# Altium project 6QChan_vitalcore_backpack.PrjPcb
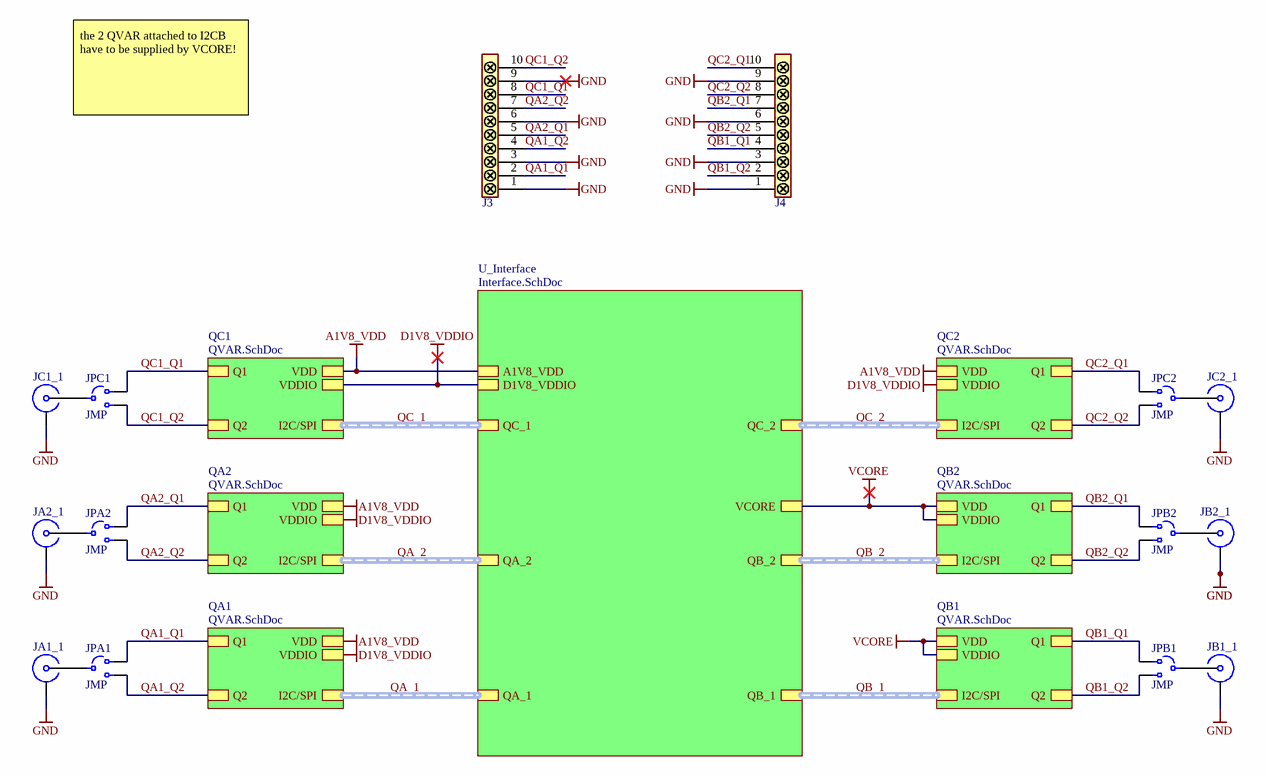
[diagram p0: main.SchDoc]
CAGE_CODE: ?????; CheckedBy: topolonelli, nschae, peterste; CONTRACT_NUMBER: <CONTRACT NO>; DOC_NO_ASSY_DWG: <ASSY DWG NO>; DOC_NO_BOM: <BOM DOC NO>; DOC_NO_FAB_DWG: <FAB DWG NO>; DOC_NO_SCH_DWG: <SCH DWG NO>; DrawnBy: villanif; Organization: PBL, IIS; PCB_2_DEC_TOL: +/-.01; PCB_3_DEC_TOL: +/-.010; PCB_ANG_TOL: +/-1/2; PCB_ASSEMBLY_NO: <PCB ASSY NO>; PCB_CHECKER: - -----; PCB_CHECKER_APP_DATE: --/--/----; PCB_DESIGNER: - -----; PCB_DESIGNER_APP_DATE: --/--/----; PCB_DWG_NO: <PCB DWG NO>; PCB_ENGINEER: - -----; PCB_ENGINEER_APP_DATE: --/--/----; PCB_PART_NUMBER: <PCB PN>; PCB_REV: A; ProjectTitle: Qvar 6 Channel Vitalcore Backpack; Revision: 1.0; SCH_REV: A
3 sheets, 119 parts. Net scope: hierarchical (ports join the sheet entries above them; power ports are global).
Board file: QVAR6_VC_Backpack.PcbDoc
Sheets:
  main.SchDoc
    QA1 = QVAR.SchDoc
    U_Interface = Interface.SchDoc
    QA2 = QVAR.SchDoc
    QB1 = QVAR.SchDoc
    QB2 = QVAR.SchDoc
    QC1 = QVAR.SchDoc
    QC2 = QVAR.SchDoc

## Sheet main.SchDoc: Main
size A4; ENG_APP_DATE: --/--/--; DSN_APP_DATE: --/--/--; CHK_APP_DATE: --/--/--; Organization: ETHZ D-ITET PBL; DocumentNumber: 1; SheetNumber: 1; SheetTotal: 3; FileInfo: main.SchDoc

### Parts
J3  FTS-110-01-L-S  [SAMTEC-FTS-110-01-L-S]  (value not drawn)
J4  FTS-110-01-L-S  [SAMTEC-FTS-110-01-L-S]  (value not drawn)
JA1_1  CONMHF1-SMD-G-T  [C-CONMHF1-SMD-G-T]  (value not drawn)
JA2_1  CONMHF1-SMD-G-T  [C-CONMHF1-SMD-G-T]  (value not drawn)
JB1_1  CONMHF1-SMD-G-T  [C-CONMHF1-SMD-G-T]  (value not drawn)
JB2_1  CONMHF1-SMD-G-T  [C-CONMHF1-SMD-G-T]  (value not drawn)
JC1_1  CONMHF1-SMD-G-T  [C-CONMHF1-SMD-G-T]  (value not drawn)
JC2_1  CONMHF1-SMD-G-T  [C-CONMHF1-SMD-G-T]  (value not drawn)
JPA1  JMP  [JMP_0201_3way]
JPA2  JMP  [JMP_0201_3way]
JPB1  JMP  [JMP_0201_3way]
JPB2  JMP  [JMP_0201_3way]
JPC1  JMP  [JMP_0201_3way]
JPC2  JMP  [JMP_0201_3way]

### Sub-sheets
QA1 = QVAR.SchDoc: Q1, Q2, VDD, VDDIO, I2C/SPI (harness I2C/SPI)
QA2 = QVAR.SchDoc: Q1, Q2, VDD, VDDIO, I2C/SPI (harness I2C/SPI)
QB1 = QVAR.SchDoc: Q1, Q2, VDD, VDDIO, I2C/SPI (harness I2C/SPI)
QB2 = QVAR.SchDoc: Q1, Q2, VDD, VDDIO, I2C/SPI (harness I2C/SPI)
QC1 = QVAR.SchDoc: Q1, Q2, VDD, VDDIO, I2C/SPI (harness I2C/SPI)
QC2 = QVAR.SchDoc: Q1, Q2, VDD, VDDIO, I2C/SPI (harness I2C/SPI)
U_Interface = Interface.SchDoc: QA_1 (harness I2C/SPI), QA_2 (harness I2C/SPI), QB_1 (harness I2C/SPI), QB_2 (harness I2C/SPI), QC_1 (harness I2C/SPI), QC_2 (harness I2C/SPI), D1V8_VDDIO, A1V8_VDD, VCORE

### Nets
A1V8_VDD: sheet QA1/VDD, sheet U_Interface/A1V8_VDD, sheet QA2/VDD, sheet QC1/VDD, sheet QC2/VDD
D1V8_VDDIO: sheet QA1/VDDIO, sheet U_Interface/D1V8_VDDIO, sheet QA2/VDDIO, sheet QC1/VDDIO, sheet QC2/VDDIO
GND: J3.1 J3.3 J3.6 J3.9 J4.1 J4.3 J4.6 J4.9 JA1_1.G JA2_1.G JB1_1.G JB2_1.G JC1_1.G JC2_1.G
VCORE: sheet U_Interface/VCORE, sheet QB1/VDD, sheet QB1/VDDIO, sheet QB2/VDD, sheet QB2/VDDIO
QA1_Q1: J3.2 JPA1.1 ; sheet QA1/Q1
QA1_Q2: J3.4 JPA1.3 ; sheet QA1/Q2
QA2_Q1: J3.5 JPA2.1 ; sheet QA2/Q1
QA2_Q2: J3.7 JPA2.3 ; sheet QA2/Q2
QB1_Q1: J4.4 JPB1.1 ; sheet QB1/Q1
QB1_Q2: J4.2 JPB1.3 ; sheet QB1/Q2
QB2_Q1: J4.7 JPB2.1 ; sheet QB2/Q1
QB2_Q2: J4.5 JPB2.3 ; sheet QB2/Q2
QC1_Q1: J3.8 JPC1.1 ; sheet QC1/Q1
QC1_Q2: J3.10 JPC1.3 ; sheet QC1/Q2
QC2_Q1: J4.10 JPC2.1 ; sheet QC2/Q1
QC2_Q2: J4.8 JPC2.3 ; sheet QC2/Q2
NetJA1_1_S: JA1_1.S JPA1.2
NetJA2_1_S: JA2_1.S JPA2.2
NetJB1_1_S: JB1_1.S JPB1.2
NetJB2_1_S: JB2_1.S JPB2.2
NetJC1_1_S: JC1_1.S JPC1.2
NetJC2_1_S: JC2_1.S JPC2.2

### Buses and harness runs
harness QA_1 = sheet QA1/I2C/SPI = sheet U_Interface/QA_1
harness QA_2 = sheet QA2/I2C/SPI = sheet U_Interface/QA_2
harness QB_1 = sheet QB1/I2C/SPI = sheet U_Interface/QB_1
harness QB_2 = sheet QB2/I2C/SPI = sheet U_Interface/QB_2
harness QC_1 = sheet QC1/I2C/SPI = sheet U_Interface/QC_1
harness QC_2 = sheet QC2/I2C/SPI = sheet U_Interface/QC_2

### Notes on the sheet
- the 2 QVAR attached to I2CB have to be supplied by VCORE!
- Project:
- Laboratory:
- Date:
- File:
- Rev:
- Variation:
- Drawn By:
- Checked By:
- Sheet:
- /

### Library data of the parts
J3 J4 = FTS-110-01-L-S: Pinheader 10 pin, 1.27mm; Manufacturer: Samtec; Manufacturer Series: FTS; Connector Type: BOARD CONNECTOR; Option: General Purpose; Mixed Contacts: No; Number of Rows Loaded: 1; Number of Contacts: 10; Additional Feature: Low Profile; Supplier 1: Mouser; Manufacturer Part Number: FTS-110-01-L-S; RoHS: Yes; Category: Connectors; Stock 1: 83; Pricing 1: 1=2.85, 10=2.62, 50=2.62, 100=2.28, 1000=1.66, 10000=1.48 (USD); Mounting Technology: Board; Contact Material: Bronze; Contact Finish - Mating: GOLD (10) OVER NICKEL (50); Contact Finish - Termination: Matte Tin (Sn) - with Nickel (Ni) barrier; JESD-609 Code: e3; Contact Gender: Male; Mounting Style: STRAIGHT; Termination: Solder; Terminal Pitch: 1.27mm; Flammability Rating: UL94 V-0; IEC Conformance: No; MIL Conformance: No; Reach SVHC Compliant: Yes; RoHS Compliant: Yes; ComponentLink1URL: https://datasheet.ciiva.com:443/pdfs/VipMasterIC/IC/SAMI/SAMI-S-A0001504673/SAMI-S-A0001504673-1.pdf?src-supplier=IHS+Markit; ComponentLink1Description: https://datasheet.ciiva.com:443/pdfs/VipMasterIC/IC/SAMI/SAMI-S-A0001504673/SAMI-S-A0001504673-1.pdf?src-supplier=IHS+Markit; Supplier Part Number 1: 200-FTS11001LS; ComponentLink2Description: http://www.samtec.com/documents/webfiles/pdf/FTS.pdf?src-supplier=Avnet; ComponentLink2URL: http://www.samtec.com/documents/webfiles/pdf/FTS.pdf?src-supplier=Avnet; ComponentLink3Description: https://datasheet.octopart.com/FTS-110-01-L-S-Samtec-datasheet-151470456.pdf?src-supplier=Sager+Electronics; ComponentLink3URL: https://datasheet.octopart.com/FTS-110-01-L-S-Samtec-datasheet-151470456.pdf?src-supplier=Sager+Electronics; ComponentLink4Description: https://datasheet.octopart.com/FTS-110-01-L-S-Samtec-datasheet-118493358.pdf?src-supplier=Electro+Sonic; ComponentLink4URL: https://datasheet.octopart.com/FTS-110-01-L-S-Samtec-datasheet-118493358.pdf?src-supplier=Electro+Sonic; ComponentLink5Description: https://datasheet.octopart.com/FTS-110-01-L-S-Samtec-datasheet-116535195.pdf?src-supplier=Toby+Electronics; ComponentLink5URL: https://datasheet.octopart.com/FTS-110-01-L-S-Samtec-datasheet-116535195.pdf?src-supplier=Toby+Electronics; DIN Conformance: No; Filter Feature: No
JA1_1 JA2_1 JB1_1 JB2_1 JC1_1 JC2_1 = CONMHF1-SMD-G-T: Conn Umc Jack Str SMD; Manufacturer: TE Connectivity; Supplier 1: Mouser; Manufacturer Part Number: CONMHF1-SMD-G-T; RoHS: No; Supplier Part Number 1: 712-CONMHF1-SMD-G-T
JPA1 JPA2 JPB1 JPB2 JPC1 JPC2 = JMP_0201_3w: JMP 0201 3W; Manufacturer: Panasonic; Manufacturer Part Number: ERJ-1GN0R00C; Package Height: 0.23mm; Package Length: 0.6mm; Package Width: 0.3mm; Power: 50mW; Rated Temperature: 70°C; Reference Standard: AEC-Q200; Value: 0R; Case/Package: 0201; Category: Chip SMD Resistors; ComponentLink1Description: https://datasheet.ciiva.com:443/pdfs/VipMasterIC/IC/PANA/PANA-S-A0009459603/PANA-S-A0009459603-1.pdf?src-supplier=IHS+Markit; ComponentLink1URL: https://datasheet.ciiva.com:443/pdfs/VipMasterIC/IC/PANA/PANA-S-A0009459603/PANA-S-A0009459603-1.pdf?src-supplier=IHS+Markit; ComponentLink2Description: https://datasheet.ciiva.com/22730/1678796-22730749.pdf?src-supplier=Element14; ComponentLink2URL: https://datasheet.ciiva.com/22730/1678796-22730749.pdf?src-supplier=Element14; Construction: Rectangular; JESD-609 Code: e3; Max Operating Temperature: 125°C; Min Operating Temperature: -55°C; Mounting Technology: Surface Mount; Package Shape: Rectangular; Package Style: SMTMeter; Packaging: Tape and Reel; Pins: 2; Pricing 1: 1=0.1, 10=0.016, 50=0.016, 100=0.007, 1000=0.007, 10000=0.005 (USD); Reach SVHC Compliant: Yes; Resistor Type: FIXED RESISTOR; RoHS: Yes; RoHS Compliant: Yes; Stock 1: 2803988; Supplier 1: Mouser; Supplier Part Number 1: 667-ERJ-1GN0R00C; Technology: METAL GLAZE/THICK FILM; Terminal Finish: Nickel; Termination: Wraparound

## Sheet QVAR.SchDoc: QVAR sensor
size A4; Organization: ETHZ D-ITET PBL, IIS; DocumentNumber: 3; SheetNumber: 3; SheetTotal: 3; FileInfo: QVAR.SchDoc
Used 6 times, as channels QA1, QA2, QB1, QB2, QC1, QC2. Parts and nets are listed once, with the designators drawn on the sheet.
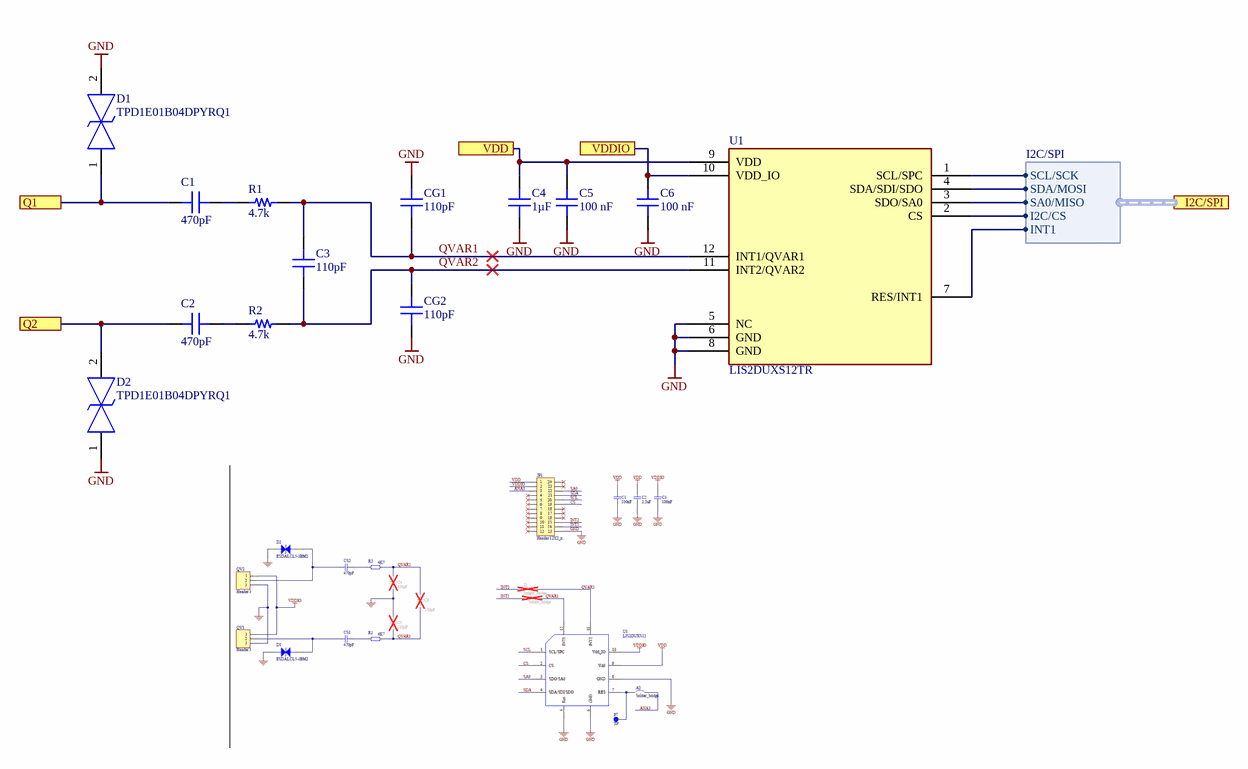
[diagram p1: QVAR.SchDoc]

### Parts
C1  470pF  [CAP_0201]
C2  470pF  [CAP_0201]
C3  110pF  [CAP_0201]
C4  1µF  [CAP_0201]
C5  100 nF  [CAP_0201]
C6  100 nF  [CAP_0201]
CG1  110pF  [CAP_0201]
CG2  110pF  [CAP_0201]
D1  TPD1E01B04DPYRQ1  [TPD1E01B04DPYRQ1]
D2  TPD1E01B04DPYRQ1  [TPD1E01B04DPYRQ1]
R1  4.7k  [RES_0201]
R2  4.7k  [RES_0201]
U1  LIS2DUXS12TR  [QFN_DUXS12_STM-M]

### Ports
I2C/SPI (harness I2C/SPI), Q1, Q2, VDD, VDDIO

### Harnesses
I2C/SPI: SCL/SCK, SDA/MOSI, SA0/MISO, I2C/CS, INT1

### Nets
GND: C4.2 C5.1 C6.1 CG1.1 CG2.1 D1.2 D2.1 U1.5(NC) U1.6(GND) U1.8(GND)
Q1: C1.1 D1.1 ; port Q1
Q2: C2.1 D2.2 ; port Q2
QVAR1: C3.1 CG1.2 R1.2 U1.12(INT1/QVAR1)
QVAR2: C3.2 CG2.2 R2.2 U1.11(INT2/QVAR2)
VDD: C4.1 C5.2 U1.9(VDD) ; port VDD
VDDIO: C6.2 U1.10(VDD_IO) ; port VDDIO
NetC1_2: C1.2 R1.1
NetC2_2: C2.2 R2.1
NetU1_1: U1.1(SCL/SPC) ; port I2C/SPI.SCL/SCK
NetU1_2: U1.2(CS) ; port I2C/SPI.I2C/CS
NetU1_3: U1.3(SDO/SA0) ; port I2C/SPI.SA0/MISO
NetU1_4: U1.4(SDA/SDI/SDO) ; port I2C/SPI.SDA/MOSI
NetU1_7: U1.7(RES/INT1) ; port I2C/SPI.INT1

### Channels
QA1: designators end in _QA1; ports Q1=QA1_Q1 Q2=QA1_Q2 VDD=A1V8_VDD VDDIO=D1V8_VDDIO
QA2: designators end in _QA2; ports Q1=QA2_Q1 Q2=QA2_Q2 VDD=A1V8_VDD VDDIO=D1V8_VDDIO
QB1: designators end in _QB1; ports Q1=QB1_Q1 Q2=QB1_Q2 VDD=VCORE VDDIO=VCORE
QB2: designators end in _QB2; ports Q1=QB2_Q1 Q2=QB2_Q2 VDD=VCORE VDDIO=VCORE
QC1: designators end in _QC1; ports Q1=QC1_Q1 Q2=QC1_Q2 VDD=A1V8_VDD VDDIO=D1V8_VDDIO
QC2: designators end in _QC2; ports Q1=QC2_Q1 Q2=QC2_Q2 VDD=A1V8_VDD VDDIO=D1V8_VDDIO

### Notes on the sheet
- Project:
- Laboratory:
- Date:
- File:
- Rev:
- Variation:
- Drawn By:
- Checked By:
- Sheet:
- /

### Library data of the parts
C1 C2 = CAP_0201_470p_25V: CAP CER 470PF 25V C0G 0201; Manufacturer: Murata; Manufacturer Part Number: GRM0335C1E471JA01D; Capacitor Type: Ceramic; Multilayer: Yes; Tolerance  (fill in as +-): 5%; Supplier 1: Mouser; RoHS: Yes; Category: Ceramic Capacitors; Stock 1: 32770; Pricing 1: 1=0.1, 10=0.007, 50=0.007, 100=0.004, 1000=0.003, 10000=0.003 (USD); Mounting Technology: Surface Mount; Pins: 2; Package Shape: Rectangular; Case/Package: 0201; Terminal Finish: Tin; Min Operating Temperature: -55°C; Max Operating Temperature: 125°C; JESD-609 Code: e3; Value: 470pF; Packaging: Tape and Reel; Rated DC Voltage (URdc): 25V; Temperature Characteristics Code: C0G; Termination: Wraparound; Reach SVHC Compliant: Yes; RoHS Compliant: Yes; ComponentLink1URL: https://psearch.en.murata.com:443/capacitor/product/GRM0335C1E471JA01%23.pdf?src-supplier=IHS+Markit; ComponentLink1Description: https://psearch.en.murata.com:443/capacitor/product/GRM0335C1E471JA01%23.pdf?src-supplier=IHS+Markit; Supplier Part Number 1: 81-GRM0335C1E471JA1D; ComponentLink2Description: http://search.murata.co.jp/Ceramy/image/img/A01X/G101/ENG/GRM0335C1E471JA01-01.pdf?src-supplier=Digi-Key; ComponentLink2URL: http://search.murata.co.jp/Ceramy/image/img/A01X/G101/ENG/GRM0335C1E471JA01-01.pdf?src-supplier=Digi-Key; ComponentLink3Description: https://search.murata.co.jp/Ceramy/image/img/A01X/G101/ENG/GRM0335C1E471JA01-01.pdf?src-supplier=Digi-Key; ComponentLink3URL: https://search.murata.co.jp/Ceramy/image/img/A01X/G101/ENG/GRM0335C1E471JA01-01.pdf?src-supplier=Digi-Key; ComponentLink4Description: https://datasheet.octopart.com/GRM0335C1E471JA01D-Murata-datasheet-165579666.pdf?src-supplier=TME; ComponentLink4URL: https://datasheet.octopart.com/GRM0335C1E471JA01D-Murata-datasheet-165579666.pdf?src-supplier=TME; Dielectric Material: Ceramic; Tolerance (fill in as +-): 5%
C3 CG1 CG2 = CAP_0201_110p_50V: CAP CER 110PF 50V C0G 0201; Manufacturer: Murata; Manufacturer Part Number: GRM0335C1H111JA01D; Capacitor Type: Ceramic; Multilayer: Yes; Tolerance  (fill in as +-): 5%; Supplier 1: Mouser; Supplier Part Number 1: 81-GRM0335C1H111JA1D; Case/Package: 0201; Category: Ceramic Capacitors; ComponentLink1Description: https://psearch.en.murata.com:443/capacitor/product/GRM0335C1H111JA01%23.pdf?src-supplier=IHS+Markit; ComponentLink1URL: https://psearch.en.murata.com:443/capacitor/product/GRM0335C1H111JA01%23.pdf?src-supplier=IHS+Markit; ComponentLink2Description: https://datasheet.ciiva.com/18699/grm0335c1h111ja01-01-18699253.pdf?src-supplier=Digi-Key; ComponentLink2URL: https://datasheet.ciiva.com/18699/grm0335c1h111ja01-01-18699253.pdf?src-supplier=Digi-Key; ComponentLink3Description: https://datasheet.ciiva.com/18699/partnumbering-e-01-18699254.pdf?src-supplier=Digi-Key; ComponentLink3URL: https://datasheet.ciiva.com/18699/partnumbering-e-01-18699254.pdf?src-supplier=Digi-Key; ComponentLink4Description: https://datasheet.ciiva.com/18699/partnumbering-e-01-18699255.pdf?src-supplier=Digi-Key; ComponentLink4URL: https://datasheet.ciiva.com/18699/partnumbering-e-01-18699255.pdf?src-supplier=Digi-Key; Dielectric Material: Ceramic; Max Operating Temperature: 125°C; Min Operating Temperature: -55°C; Mounting Technology: Surface Mount; Package Shape: Rectangular; Packaging: Tape and Reel; Pins: 2; Pricing 1: 1=0.1, 10=0.006, 50=0.006, 100=0.004, 1000=0.003, 10000=0.002 (USD); Rated DC Voltage (URdc): 50V; Reach SVHC Compliant: Yes; RoHS: Yes; RoHS Compliant: Yes; Stock 1: 26582; Temperature Characteristics Code: C0G; Termination: Wraparound; Tolerance (fill in as +-): 5%; Value: 110pF
C4 = CAP_0201_1u_10V: CAP CER 1UF 10V X6S; Manufacturer: Murata; Manufacturer Part Number: GRM033C81A105ME05D; Capacitor Type: Ceramic; Multilayer: Yes; Tolerance  (fill in as +-): 20%; Supplier 1: Mouser; Supplier Part Number 1: 81-GRM033C81A105ME5D; Case/Package: 0201; Category: Ceramic Capacitors; ComponentLink1Description: https://psearch.en.murata.com:443/capacitor/product/GRM033C81A105ME05%23.pdf?src-supplier=IHS+Markit; ComponentLink1URL: https://psearch.en.murata.com:443/capacitor/product/GRM033C81A105ME05%23.pdf?src-supplier=IHS+Markit; ComponentLink2Description: http://search.murata.co.jp/Ceramy/image/img/A01X/G101/ENG/GRM033C81A105ME05-01.pdf?src-supplier=Digi-Key; ComponentLink2URL: http://search.murata.co.jp/Ceramy/image/img/A01X/G101/ENG/GRM033C81A105ME05-01.pdf?src-supplier=Digi-Key; ComponentLink3Description: https://datasheet.octopart.com/GRM033C81A105ME05D-Murata-datasheet-86813717.pdf?src-supplier=Future+Electronics; ComponentLink3URL: https://datasheet.octopart.com/GRM033C81A105ME05D-Murata-datasheet-86813717.pdf?src-supplier=Future+Electronics; ComponentLink4Description: https://datasheet.octopart.com/GRM033C81A105ME05D-Murata-datasheet-165579666.pdf?src-supplier=TME; ComponentLink4URL: https://datasheet.octopart.com/GRM033C81A105ME05D-Murata-datasheet-165579666.pdf?src-supplier=TME; Dielectric Material: Ceramic; JESD-609 Code: e3; Max Operating Temperature: 105°C; Min Operating Temperature: -55°C; Mounting Technology: Surface Mount; Package Shape: Rectangular; Packaging: Tape and Reel; Pins: 2; Pricing 1: 1=0.3, 10=0.147, 50=0.147, 100=0.095, 1000=0.079, 10000=0.066 (USD); Rated DC Voltage (URdc): 10V; Reach SVHC Compliant: Yes; RoHS: Yes; RoHS Compliant: Yes; Stock 1: 212716; Temperature Characteristics Code: X6S; Terminal Finish: Nickel; Termination: Wraparound; Tolerance (fill in as +-): 20%; Value: 1uF
C5 C6 = CAP_0201_100n_10V: CAP CER 0.1UF 25V X5R 0201; Manufacturer: Murata; Manufacturer Part Number: GRM033R6YA104ME14D; Capacitor Type: Ceramic; Multilayer: Yes; Rated DC Voltage (URdc): 35V; Tolerance  (fill in as +-): 20%; Value: 100nF; Supplier 1: Mouser; Supplier Part Number 1: 81-GRM33R6YA104ME14D; Case/Package: 0201; Category: Ceramic Capacitors; ComponentLink1Description: https://psearch.en.murata.com:443/capacitor/product/GRM033R6YA104ME14%23.pdf?src-supplier=IHS+Markit; ComponentLink1URL: https://psearch.en.murata.com:443/capacitor/product/GRM033R6YA104ME14%23.pdf?src-supplier=IHS+Markit; ComponentLink2Description: http://www.mouser.com/ds/2/281/c02e-2905.pdf?src-supplier=Mouser; ComponentLink2URL: http://www.mouser.com/ds/2/281/c02e-2905.pdf?src-supplier=Mouser; ComponentLink3Description: http://search.murata.co.jp/Ceramy/image/img/A01X/G101/ENG/GRM033R6YA104ME14-01.pdf?src-supplier=Digi-Key; ComponentLink3URL: http://search.murata.co.jp/Ceramy/image/img/A01X/G101/ENG/GRM033R6YA104ME14-01.pdf?src-supplier=Digi-Key; ComponentLink4Description: https://datasheet.octopart.com/GRM033R6YA104ME14D-Murata-datasheet-82944622.pdf?src-supplier=Future+Electronics; ComponentLink4URL: https://datasheet.octopart.com/GRM033R6YA104ME14D-Murata-datasheet-82944622.pdf?src-supplier=Future+Electronics; Dielectric Material: Ceramic; Height: 0.3mm; JESD-609 Code: e3; Length: 0.6mm; Max Operating Temperature: 85°C; Min Operating Temperature: -55°C; Mounting Technology: Surface Mount; Package Shape: Rectangular; Package Style: SMTMeter; Packaging: Tape and Reel; Pins: 2; Pricing 1: 1=0.1, 10=0.013, 50=0.013, 100=0.008, 1000=0.006, 10000=0.005 (USD); Reach SVHC Compliant: Yes; RoHS: Yes; RoHS Compliant: Yes; Stock 1: 286132; Temperature Characteristics Code: X5R; Terminal Finish: Nickel; Termination: Wraparound; Tolerance (fill in as +-): 20%; Width: 0.3mm
D1 D2 = TPD1E01B04DPYRQ1: TVS Diode (Bi-directional); Manufacturer: Texas Instruments; Manufacturer Part Number: TPD1E01B04DPYRQ1; Category: Integrated Circuits (ICs); Pricing 1: 1=0.48, 10=0.358, 50=0.358, 100=0.229, 1000=0.143, 10000=0.114 (USD); RoHS: No; Stock 1: 7769; Supplier 1: Mouser; Supplier Part Number 1: 595-TPD1E01B04DPYRQ1
R1 R2 = R_0201_4.7K: R 4.7K 1% 50mW 0201; Manufacturer: Panasonic; Manufacturer Part Number: ERJ-1GNF4701C; Rated Temperature: 70°C; Temperature Coefficient: 200ppm/°C; Working Voltage: 25V; Package Height: 0.23mm; Package Length: 0.6mm; Package Width: 0.3mm; Reference Standard: AEC-Q200; Supplier 1: Mouser; RoHS: Yes; Category: Chip SMD Resistors; Stock 1: 339994; Pricing 1: 1=0.1, 10=0.023, 50=0.023, 100=0.014, 1000=0.01, 10000=0.007 (USD); Mounting Technology: Surface Mount; Pins: 2; Package Shape: Rectangular; Case/Package: 0201; Terminal Finish: Nickel; Min Operating Temperature: -55°C; Max Operating Temperature: 125°C; Tolerance: 1%; JESD-609 Code: e3; Resistor Type: FIXED RESISTOR; Construction: Rectangular; Package Style: SMTMeter; Packaging: Tape and Reel; Power: 50mW; Value: 4.7k; Technology: METAL GLAZE/THICK FILM; Termination: Wraparound; Reach SVHC Compliant: Yes; RoHS Compliant: Yes; ComponentLink1URL: https://datasheet.ciiva.com:443/pdfs/VipMasterIC/IC/PANA/PANA-S-A0009889626/PANA-S-A0009889626-1.pdf?src-supplier=IHS+Markit; ComponentLink1Description: https://datasheet.ciiva.com:443/pdfs/VipMasterIC/IC/PANA/PANA-S-A0009889626/PANA-S-A0009889626-1.pdf?src-supplier=IHS+Markit; Supplier Part Number 1: 667-ERJ-1GNF4701C; ComponentLink2Description: https://datasheet.ciiva.com/30079/erj1gn-30079779.pdf?src-supplier=Onlinecomponents.com; ComponentLink2URL: https://datasheet.ciiva.com/30079/erj1gn-30079779.pdf?src-supplier=Onlinecomponents.com
U1 = LIS2DUXS12TR: IC IMU QVAR; Manufacturer: STMicroelectronics; Manufacturer Part Number: LIS2DUXS12TR; Category: Uncategorized; Pricing 1: 1=3.99, 10=2.53, 50=2.53, 100=2.45, 1000=1.93, 10000=1.69 (USD); RoHS: No; Stock 1: 1438; Supplier 1: Mouser; Supplier Part Number 1: 511-LIS2DUXS12TR

## Sheet Interface.SchDoc: VitalCore Interface
size A4; Organization: ETHZ D-ITET PBL, IIS; DocumentNumber: 2; SheetNumber: 2; SheetTotal: 3; FileInfo: Interface.SchDoc
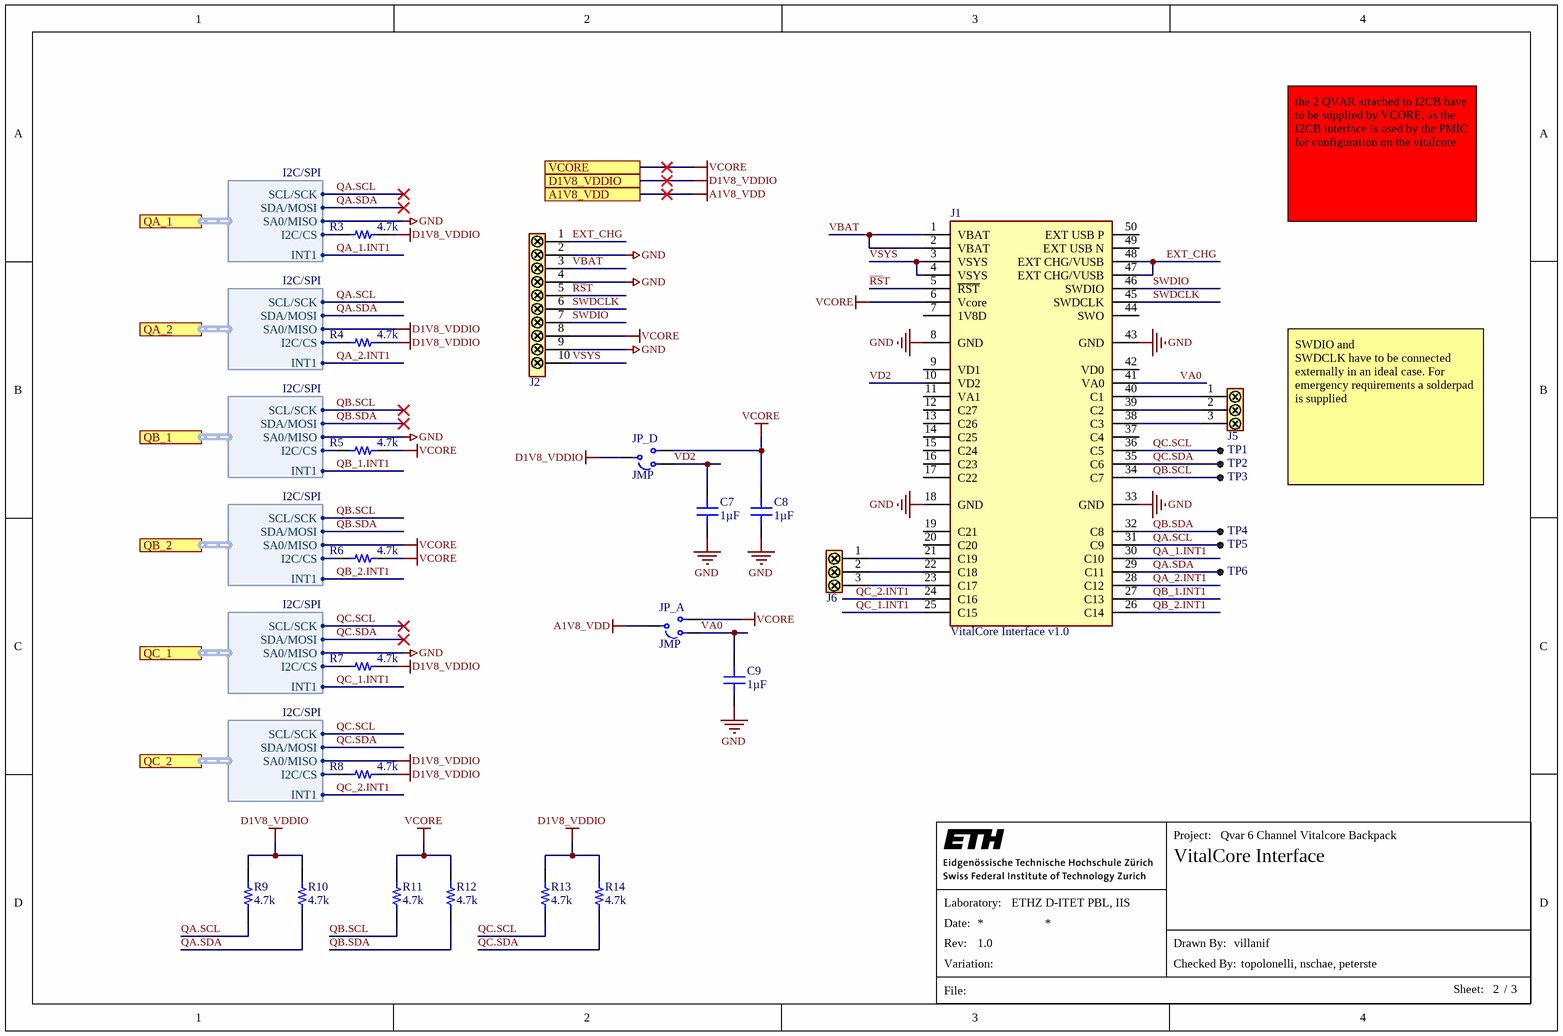
[diagram p2: Interface.SchDoc]

### Parts
C7  1µF  [CAP_0201]
C8  1µF  [CAP_0201]
C9  1µF  [CAP_0201]
J1  VitalCore Interface v1.0  [BACKPACK_INTERFACE_V1.0_2mm]
J2  FTS-110-01-L-S  [SAMTEC-FTS-110-01-L-S]  (value not drawn)
J5  FTS-103-01-L-S  [SAMTEC-FTS-103-01-X-S]  (value not drawn)
J6  FTS-103-01-L-S  [SAMTEC-FTS-103-01-X-S]  (value not drawn)
JP_A  JMP  [JMP_0201_3way]
JP_D  JMP  [JMP_0201_3way]
R3  4.7k  [RES_0201]
R4  4.7k  [RES_0201]
R5  4.7k  [RES_0201]
R6  4.7k  [RES_0201]
R7  4.7k  [RES_0201]
R8  4.7k  [RES_0201]
R9  4.7k  [RES_0201]
R10  4.7k  [RES_0201]
R11  4.7k  [RES_0201]
R12  4.7k  [RES_0201]
R13  4.7k  [RES_0201]
R14  4.7k  [RES_0201]
TP1  (no value)  [Pad-0.6mm]  (no BOM)
TP2  (no value)  [Pad-0.6mm]  (no BOM)
TP3  (no value)  [Pad-0.6mm]  (no BOM)
TP4  (no value)  [Pad-0.6mm]  (no BOM)
TP5  (no value)  [Pad-0.6mm]  (no BOM)
TP6  (no value)  [Pad-0.6mm]  (no BOM)

### Ports
A1V8_VDD, D1V8_VDDIO, QA_1 (harness I2C/SPI), QA_2 (harness I2C/SPI), QB_1 (harness I2C/SPI), QB_2 (harness I2C/SPI), QC_1 (harness I2C/SPI), QC_2 (harness I2C/SPI), VCORE

### Harnesses
I2C/SPI: SCL/SCK, SDA/MOSI, SA0/MISO, I2C/CS, INT1

### Nets
A1V8_VDD: JP_A.2 ; port A1V8_VDD
D1V8_VDDIO: JP_D.2 R3.1 R4.1 R7.1 R8.1 R9.1 R10.1 R13.1 R14.1 ; port D1V8_VDDIO, port QA_2.SA0/MISO, port QC_2.SA0/MISO
GND: C7.2 C8.2 C9.2 J1.8(GND) J1.18(GND) J1.33(GND) J1.43(GND) J2.2 J2.4 J2.9 ; port QA_1.SA0/MISO, port QB_1.SA0/MISO, port QC_1.SA0/MISO
VCORE: C8.1 J1.6(Vcore) J2.8 JP_A.3 JP_D.3 R5.1 R6.1 R11.1 R12.1 ; port VCORE, port QB_2.SA0/MISO
EXT_CHG: J1.47(EXT_CHG/VUSB) J1.48(EXT_CHG/VUSB) J2.1
QA.SCL: J1.31(C9) R9.2 TP5.1 ; port QA_1.SCL/SCK, port QA_2.SCL/SCK  [project net QA_1.SCL/SCK]
QA.SDA: J1.29(C11) R10.2 TP6.1 ; port QA_1.SDA/MOSI, port QA_2.SDA/MOSI  [project net QA_1.SDA/MOSI]
QA_1.I2C/CS: R3.2 ; port QA_1.I2C/CS
QA_1.INT1: J1.30(C10) ; port QA_1.INT1
QA_2.I2C/CS: R4.2 ; port QA_2.I2C/CS
QA_2.INT1: J1.28(C12) ; port QA_2.INT1
QB.SCL: J1.34(C7) R11.2 TP3.1 ; port QB_1.SCL/SCK, port QB_2.SCL/SCK  [project net QB_1.SCL/SCK]
QB.SDA: J1.32(C8) R12.2 TP4.1 ; port QB_1.SDA/MOSI, port QB_2.SDA/MOSI  [project net QB_1.SDA/MOSI]
QB_1.I2C/CS: R5.2 ; port QB_1.I2C/CS
QB_1.INT1: J1.27(C13) ; port QB_1.INT1
QB_2.I2C/CS: R6.2 ; port QB_2.I2C/CS
QB_2.INT1: J1.26(C14) ; port QB_2.INT1
QC.SCL: J1.36(C5) R13.2 TP1.1 ; port QC_1.SCL/SCK, port QC_2.SCL/SCK  [project net QC_1.SCL/SCK]
QC.SDA: J1.35(C6) R14.2 TP2.1 ; port QC_1.SDA/MOSI, port QC_2.SDA/MOSI  [project net QC_1.SDA/MOSI]
QC_1.I2C/CS: R7.2 ; port QC_1.I2C/CS
QC_1.INT1: J1.25(C15) ; port QC_1.INT1
QC_2.I2C/CS: R8.2 ; port QC_2.I2C/CS
QC_2.INT1: J1.24(C16) ; port QC_2.INT1
~{RS}T: J1.5(~{RST}) J2.5
SWDCLK: J1.45(SWDCLK) J2.6
SWDIO: J1.46(SWDIO) J2.7
VA0: C9.1 J1.41(VA0) JP_A.1
VBAT: J1.1(VBAT) J1.2(VBAT) J2.3
VD2: C7.1 J1.10(VD2) JP_D.1
VSYS: J1.3(VSYS) J1.4(VSYS) J2.10
NetJ1_21: J1.21(C19) J6.1
NetJ1_22: J1.22(C18) J6.2
NetJ1_23: J1.23(C17) J6.3
NetJ1_38: J1.38(C3) J5.3
NetJ1_39: J1.39(C2) J5.2
NetJ1_40: J1.40(C1) J5.1

Not connected (* = marked no-connect by the designer): J1 7(1V8D) 9(VD1) 11(VA1) 12(C27) 13(C26) 14(C25) 15(C24) 16(C23) 17(C22) 19(C21) 20(C20) 37(C4) 42(VD0) 44(SWO) 49(EXT_USB_N) 50(EXT_USB_P)

### Notes on the sheet
- the 2 QVAR attached to I2CB have to be supplied by VCORE, as the I2CB interface is used by the PMIC for configuration on the vitalcore
- SWDIO and
  SWDCLK have to be connected externally in an ideal case. For emergency requirements a solderpad is supplied
- Project:
- Laboratory:
- Date:
- File:
- Rev:
- Variation:
- Drawn By:
- Checked By:
- Sheet:
- /

### Library data of the parts
C7-C9 = CAP_0201_1u_10V: as C4 on sheet QVAR; Supplier 1: Mouser; Supplier Part Number 1: 81-GRM033C81A105ME5D; Case/Package: 0201; Category: Ceramic Capacitors; ComponentLink1Description: https://psearch.en.murata.com:443/capacitor/product/GRM033C81A105ME05%23.pdf?src-supplier=IHS+Markit; ComponentLink1URL: https://psearch.en.murata.com:443/capacitor/product/GRM033C81A105ME05%23.pdf?src-supplier=IHS+Markit; ComponentLink2Description: http://search.murata.co.jp/Ceramy/image/img/A01X/G101/ENG/GRM033C81A105ME05-01.pdf?src-supplier=Digi-Key; ComponentLink2URL: http://search.murata.co.jp/Ceramy/image/img/A01X/G101/ENG/GRM033C81A105ME05-01.pdf?src-supplier=Digi-Key; ComponentLink3Description: https://datasheet.octopart.com/GRM033C81A105ME05D-Murata-datasheet-86813717.pdf?src-supplier=Future+Electronics; ComponentLink3URL: https://datasheet.octopart.com/GRM033C81A105ME05D-Murata-datasheet-86813717.pdf?src-supplier=Future+Electronics; ComponentLink4Description: https://datasheet.octopart.com/GRM033C81A105ME05D-Murata-datasheet-165579666.pdf?src-supplier=TME; ComponentLink4URL: https://datasheet.octopart.com/GRM033C81A105ME05D-Murata-datasheet-165579666.pdf?src-supplier=TME; Dielectric Material: Ceramic; JESD-609 Code: e3; Max Operating Temperature: 105°C; Min Operating Temperature: -55°C; Mounting Technology: Surface Mount; Package Shape: Rectangular; Packaging: Tape and Reel; Pins: 2; Pricing 1: 1=0.3, 10=0.147, 50=0.147, 100=0.095, 1000=0.079, 10000=0.066 (USD); Rated DC Voltage (URdc): 10V; Reach SVHC Compliant: Yes; RoHS: Yes; RoHS Compliant: Yes; Stock 1: 212716; Temperature Characteristics Code: X6S; Terminal Finish: Nickel; Termination: Wraparound; Tolerance (fill in as +-): 20%; Value: 1uF
J1 = BACKPACK_INTERFACE_V1.0: Manufacturer: Hirose; Manufacturer Part Number: DF40C(2.0)-50DS-0.4V(51); Manufacturer Series: DF40; Body/Shell Style: RECEPTACLE; Connector Type: BOARD STACKING CONNECTOR; Contact Pattern: RECTANGULAR; Contact Resistance: 90mR; Dielectric Withstanding Voltage (AC): 100V; Durability: 30Cycles; Insulation Resistance: 50MR; Mating Contact Pitch: 0.016inch; Mounting Option 1: LOCKING; Number Of Connectors: 1; Number of Contacts: 50; Number Of PCB Rows: 2; PCB Contact Row Spacing: 2.6416mm; Polarization Key: POLARIZED HOUSING; Rated Current (Signal): 300mA; Reference Standard: UL; Reliability: COMMERCIAL; Supplier 1: Mouser; Supplier Part Number 1: 798-DF40C2050DS04V51; Category: Connectors; ComponentLink1Description: https://datasheet.ciiva.com:443/pdfs/VipMasterIC/IC/HIRO/HIRO-S-A0003089604/HIRO-S-A0007946763-1.pdf?src-supplier=IHS+Markit; ComponentLink1URL: https://datasheet.ciiva.com:443/pdfs/VipMasterIC/IC/HIRO/HIRO-S-A0003089604/HIRO-S-A0007946763-1.pdf?src-supplier=IHS+Markit; ComponentLink2Description: https://www.hirose.com/product/download/?distributor=digikey&amp;type=specSheet&amp;lang=en&amp;num=DF40C(2.0)-50DS-0.4V(51)&src-supplier=Digi-Key; ComponentLink2URL: https://www.hirose.com/product/download/?distributor=digikey&amp;type=specSheet&amp;lang=en&amp;num=DF40C(2.0)-50DS-0.4V(51)&src-supplier=Digi-Key; ComponentLink3Description: https://www.hirose.com/product/en/download_file/key_name/DF40C%282.0%29-50DS-0.4V%2851%29/category/Specification%20Sheet/doc_file_id/46910/?file_category_id=9&item_id=06844091051&is_series=&src-supplier=Digi-Key; ComponentLink3URL: https://www.hirose.com/product/en/download_file/key_name/DF40C%282.0%29-50DS-0.4V%2851%29/category/Specification%20Sheet/doc_file_id/46910/?file_category_id=9&item_id=06844091051&is_series=&src-supplier=Digi-Key; ComponentLink4Description: http://www.hirose.co.jp/cataloge_hp/e68440018.pdf?src-supplier=Mouser; ComponentLink4URL: http://www.hirose.co.jp/cataloge_hp/e68440018.pdf?src-supplier=Mouser; Contact Finish - Mating: AU; Contact Gender: Female; Contact Material: Bronze; Insulation Color: Black; Insulation Material: Polymer; Max Operating Temperature: 85°C; Min Operating Temperature: -35°C; Mounting Style: STRAIGHT; Mounting Technology: Board; Number of Rows Loaded: 2; PCB Contact Pattern: RECTANGULAR; Pricing 1: 1=1.44, 10=1.14, 50=1.14, 100=0.99, 1000=0.792, 10000=0.643 (USD); RoHS: Yes; RoHS Compliant: Yes; Stock 1: 16932; Terminal Pitch: 4.064mm; Termination: SMD/SMT
J2 = FTS-110-01-L-S: as J3 on sheet main; Supplier 1: Mouser; Manufacturer Part Number: FTS-110-01-L-S; RoHS: Yes; Category: Connectors; Stock 1: 83; Pricing 1: 1=2.85, 10=2.62, 50=2.62, 100=2.28, 1000=1.66, 10000=1.48 (USD); Mounting Technology: Board; Contact Material: Bronze; Contact Finish - Mating: GOLD (10) OVER NICKEL (50); Contact Finish - Termination: Matte Tin (Sn) - with Nickel (Ni) barrier; JESD-609 Code: e3; Contact Gender: Male; Mounting Style: STRAIGHT; Termination: Solder; Terminal Pitch: 1.27mm; Flammability Rating: UL94 V-0; IEC Conformance: No; MIL Conformance: No; Reach SVHC Compliant: Yes; RoHS Compliant: Yes; ComponentLink1URL: https://datasheet.ciiva.com:443/pdfs/VipMasterIC/IC/SAMI/SAMI-S-A0001504673/SAMI-S-A0001504673-1.pdf?src-supplier=IHS+Markit; ComponentLink1Description: https://datasheet.ciiva.com:443/pdfs/VipMasterIC/IC/SAMI/SAMI-S-A0001504673/SAMI-S-A0001504673-1.pdf?src-supplier=IHS+Markit; Supplier Part Number 1: 200-FTS11001LS; ComponentLink2Description: http://www.samtec.com/documents/webfiles/pdf/FTS.pdf?src-supplier=Avnet; ComponentLink2URL: http://www.samtec.com/documents/webfiles/pdf/FTS.pdf?src-supplier=Avnet; ComponentLink3Description: https://datasheet.octopart.com/FTS-110-01-L-S-Samtec-datasheet-151470456.pdf?src-supplier=Sager+Electronics; ComponentLink3URL: https://datasheet.octopart.com/FTS-110-01-L-S-Samtec-datasheet-151470456.pdf?src-supplier=Sager+Electronics; ComponentLink4Description: https://datasheet.octopart.com/FTS-110-01-L-S-Samtec-datasheet-118493358.pdf?src-supplier=Electro+Sonic; ComponentLink4URL: https://datasheet.octopart.com/FTS-110-01-L-S-Samtec-datasheet-118493358.pdf?src-supplier=Electro+Sonic; ComponentLink5Description: https://datasheet.octopart.com/FTS-110-01-L-S-Samtec-datasheet-116535195.pdf?src-supplier=Toby+Electronics; ComponentLink5URL: https://datasheet.octopart.com/FTS-110-01-L-S-Samtec-datasheet-116535195.pdf?src-supplier=Toby+Electronics; DIN Conformance: No; Filter Feature: No
J5 J6 = FTS-103-01-L-S: Pinheader 3 pin, 1.27mm; Manufacturer: Samtec; Manufacturer Series: FTS; Connector Type: BOARD CONNECTOR; Option: General Purpose; Mixed Contacts: No; Number of Rows Loaded: 1; Number of Contacts: 3; Additional Feature: Low Profile; Supplier 1: Mouser; Manufacturer Part Number: FTS-103-01-L-S; RoHS: Yes; Category: Connectors; Stock 1: 1110; Pricing 1: 1=1.18, 10=1.18, 50=1.18, 100=0.887, 1000=0.65, 10000=0.481 (USD); Mounting Technology: Board; Contact Material: Bronze; Contact Finish - Mating: GOLD (10) OVER NICKEL (50); Contact Finish - Termination: Matte Tin (Sn) - with Nickel (Ni) barrier; JESD-609 Code: e3; Contact Gender: Male; Mounting Style: STRAIGHT; Termination: Solder; Terminal Pitch: 1.27mm; Flammability Rating: UL94 V-0; IEC Conformance: No; MIL Conformance: No; Reach SVHC Compliant: Yes; RoHS Compliant: Yes; ComponentLink1URL: https://datasheet.ciiva.com:443/pdfs/VipMasterIC/IC/SAMI/SAMI-S-A0001504673/SAMI-S-A0001504673-1.pdf?src-supplier=IHS+Markit; ComponentLink1Description: https://datasheet.ciiva.com:443/pdfs/VipMasterIC/IC/SAMI/SAMI-S-A0001504673/SAMI-S-A0001504673-1.pdf?src-supplier=IHS+Markit; ComponentLink2Description: http://suddendocs.samtec.com/prints/fts-1xx-xx-x-sx-mkt.pdf?src-supplier=Digi-Key; ComponentLink2URL: http://suddendocs.samtec.com/prints/fts-1xx-xx-x-sx-mkt.pdf?src-supplier=Digi-Key; ComponentLink3Description: http://suddendocs.samtec.com/prints/fts-1xx-xx-xx-xx-xx-mkt.pdf?src-supplier=Digi-Key; ComponentLink3URL: http://suddendocs.samtec.com/prints/fts-1xx-xx-xx-xx-xx-mkt.pdf?src-supplier=Digi-Key; ComponentLink4Description: ftp://ftp.samtec.com/webfiles/PDF/FTS.PDF?src-supplier=Avnet; ComponentLink4URL: ftp://ftp.samtec.com/webfiles/PDF/FTS.PDF?src-supplier=Avnet; DIN Conformance: No; Filter Feature: No; Supplier Part Number 1: 200-FTS10301LS
JP_A JP_D = JMP_0201_3w: as JPA1 on sheet main; Case/Package: 0201; Category: Chip SMD Resistors; ComponentLink1Description: https://datasheet.ciiva.com:443/pdfs/VipMasterIC/IC/PANA/PANA-S-A0009459603/PANA-S-A0009459603-1.pdf?src-supplier=IHS+Markit; ComponentLink1URL: https://datasheet.ciiva.com:443/pdfs/VipMasterIC/IC/PANA/PANA-S-A0009459603/PANA-S-A0009459603-1.pdf?src-supplier=IHS+Markit; ComponentLink2Description: https://datasheet.ciiva.com/22730/1678796-22730749.pdf?src-supplier=Element14; ComponentLink2URL: https://datasheet.ciiva.com/22730/1678796-22730749.pdf?src-supplier=Element14; Construction: Rectangular; JESD-609 Code: e3; Max Operating Temperature: 125°C; Min Operating Temperature: -55°C; Mounting Technology: Surface Mount; Package Shape: Rectangular; Package Style: SMTMeter; Packaging: Tape and Reel; Pins: 2; Pricing 1: 1=0.1, 10=0.016, 50=0.016, 100=0.007, 1000=0.007, 10000=0.005 (USD); Reach SVHC Compliant: Yes; Resistor Type: FIXED RESISTOR; RoHS: Yes; RoHS Compliant: Yes; Stock 1: 2803988; Supplier 1: Mouser; Supplier Part Number 1: 667-ERJ-1GN0R00C; Technology: METAL GLAZE/THICK FILM; Terminal Finish: Nickel; Termination: Wraparound
R3-R14 = R_0201_4.7K: as R1 on sheet QVAR; Supplier 1: Mouser; RoHS: Yes; Category: Chip SMD Resistors; Stock 1: 339994; Pricing 1: 1=0.1, 10=0.023, 50=0.023, 100=0.014, 1000=0.01, 10000=0.007 (USD); Mounting Technology: Surface Mount; Pins: 2; Package Shape: Rectangular; Case/Package: 0201; Terminal Finish: Nickel; Min Operating Temperature: -55°C; Max Operating Temperature: 125°C; Tolerance: 1%; JESD-609 Code: e3; Resistor Type: FIXED RESISTOR; Construction: Rectangular; Package Style: SMTMeter; Packaging: Tape and Reel; Power: 50mW; Value: 4.7k; Technology: METAL GLAZE/THICK FILM; Termination: Wraparound; Reach SVHC Compliant: Yes; RoHS Compliant: Yes; ComponentLink1URL: https://datasheet.ciiva.com:443/pdfs/VipMasterIC/IC/PANA/PANA-S-A0009889626/PANA-S-A0009889626-1.pdf?src-supplier=IHS+Markit; ComponentLink1Description: https://datasheet.ciiva.com:443/pdfs/VipMasterIC/IC/PANA/PANA-S-A0009889626/PANA-S-A0009889626-1.pdf?src-supplier=IHS+Markit; Supplier Part Number 1: 667-ERJ-1GNF4701C; ComponentLink2Description: https://datasheet.ciiva.com/30079/erj1gn-30079779.pdf?src-supplier=Onlinecomponents.com; ComponentLink2URL: https://datasheet.ciiva.com/30079/erj1gn-30079779.pdf?src-supplier=Onlinecomponents.com
TP1-TP6 = CMP-00224-2: 0.6mm SMT Test Pad; Mounting Technology: SMT

## Nets that join several sheets
A1V8_VDD: QA1 (C4_QA1.1 C5_QA1.2 U1_QA1.9), Interface (JP_A.2), QA2 (C4_QA2.1 C5_QA2.2 U1_QA2.9), QC1 (C4_QC1.1 C5_QC1.2 U1_QC1.9), QC2 (C4_QC2.1 C5_QC2.2 U1_QC2.9)
D1V8_VDDIO: QA1 (C6_QA1.2 U1_QA1.10), Interface (9 pins), QA2 (C6_QA2.2 U1_QA2.3 U1_QA2.10), QC1 (C6_QC1.2 U1_QC1.10), QC2 (C6_QC2.2 U1_QC2.3 U1_QC2.10)
GND: main (14 pins), QA1 (11 pins), Interface (10 pins), QA2 (10 pins), QB1 (11 pins), QB2 (10 pins), QC1 (11 pins), QC2 (10 pins)
VCORE: Interface (9 pins), QB1 (5 pins), QB2 (6 pins)
QA1_Q1: main (J3.2 JPA1.1), QA1 (C1_QA1.1 D1_QA1.1)
QA1_Q2: main (J3.4 JPA1.3), QA1 (C2_QA1.1 D2_QA1.2)
QA2_Q1: main (J3.5 JPA2.1), QA2 (C1_QA2.1 D1_QA2.1)
QA2_Q2: main (J3.7 JPA2.3), QA2 (C2_QA2.1 D2_QA2.2)
QA_1.I2C/CS: QA1 (U1_QA1.2), Interface (R3.2)
QA_1.INT1: QA1 (U1_QA1.7), Interface (J1.30)
QA_1.SCL/SCK: QA1 (U1_QA1.1), Interface (J1.31 R9.2 TP5.1), QA2 (U1_QA2.1)
QA_1.SDA/MOSI: QA1 (U1_QA1.4), Interface (J1.29 R10.2 TP6.1), QA2 (U1_QA2.4)
QA_2.I2C/CS: Interface (R4.2), QA2 (U1_QA2.2)
QA_2.INT1: Interface (J1.28), QA2 (U1_QA2.7)
QB1_Q1: main (J4.4 JPB1.1), QB1 (C1_QB1.1 D1_QB1.1)
QB1_Q2: main (J4.2 JPB1.3), QB1 (C2_QB1.1 D2_QB1.2)
QB2_Q1: main (J4.7 JPB2.1), QB2 (C1_QB2.1 D1_QB2.1)
QB2_Q2: main (J4.5 JPB2.3), QB2 (C2_QB2.1 D2_QB2.2)
QB_1.I2C/CS: Interface (R5.2), QB1 (U1_QB1.2)
QB_1.INT1: Interface (J1.27), QB1 (U1_QB1.7)
QB_1.SCL/SCK: Interface (J1.34 R11.2 TP3.1), QB1 (U1_QB1.1), QB2 (U1_QB2.1)
QB_1.SDA/MOSI: Interface (J1.32 R12.2 TP4.1), QB1 (U1_QB1.4), QB2 (U1_QB2.4)
QB_2.I2C/CS: Interface (R6.2), QB2 (U1_QB2.2)
QB_2.INT1: Interface (J1.26), QB2 (U1_QB2.7)
QC1_Q1: main (J3.8 JPC1.1), QC1 (C1_QC1.1 D1_QC1.1)
QC1_Q2: main (J3.10 JPC1.3), QC1 (C2_QC1.1 D2_QC1.2)
QC2_Q1: main (J4.10 JPC2.1), QC2 (C1_QC2.1 D1_QC2.1)
QC2_Q2: main (J4.8 JPC2.3), QC2 (C2_QC2.1 D2_QC2.2)
QC_1.I2C/CS: Interface (R7.2), QC1 (U1_QC1.2)
QC_1.INT1: Interface (J1.25), QC1 (U1_QC1.7)
QC_1.SCL/SCK: Interface (J1.36 R13.2 TP1.1), QC1 (U1_QC1.1), QC2 (U1_QC2.1)
QC_1.SDA/MOSI: Interface (J1.35 R14.2 TP2.1), QC1 (U1_QC1.4), QC2 (U1_QC2.4)
QC_2.I2C/CS: Interface (R8.2), QC2 (U1_QC2.2)
QC_2.INT1: Interface (J1.24), QC2 (U1_QC2.7)

## Assembly variants
Fabrication: not fitted C3_QA1 C3_QA2 C3_QB1 C3_QB2 C3_QC1 C3_QC2 J2 J3 J4 J5 J6 JA1_1 JA2_1 JB1_1 JB2_1 JC1_1 JC2_1 JPA1 JPA2 JPB1 JPB2 JPC1 JPC2 R3 R4 R5 R6 R7 R8 R9 R10 R11 R12 R13 R14; alternate parts C1_QA1 -> R_0201_0R_short_cap, C1_QA2 -> R_0201_0R_short_cap, C1_QB1 -> R_0201_0R_short_cap, C1_QB2 -> R_0201_0R_short_cap, C1_QC1 -> R_0201_0R_short_cap, C1_QC2 -> R_0201_0R_short_cap, C2_QA1 -> R_0201_0R_short_cap, C2_QA2 -> R_0201_0R_short_cap, C2_QB1 -> R_0201_0R_short_cap, C2_QB2 -> R_0201_0R_short_cap, C2_QC1 -> R_0201_0R_short_cap, C2_QC2 -> R_0201_0R_short_cap